# Altium schematic sheet 2401_Test_Board_V1.1.SCHDOC
size A4
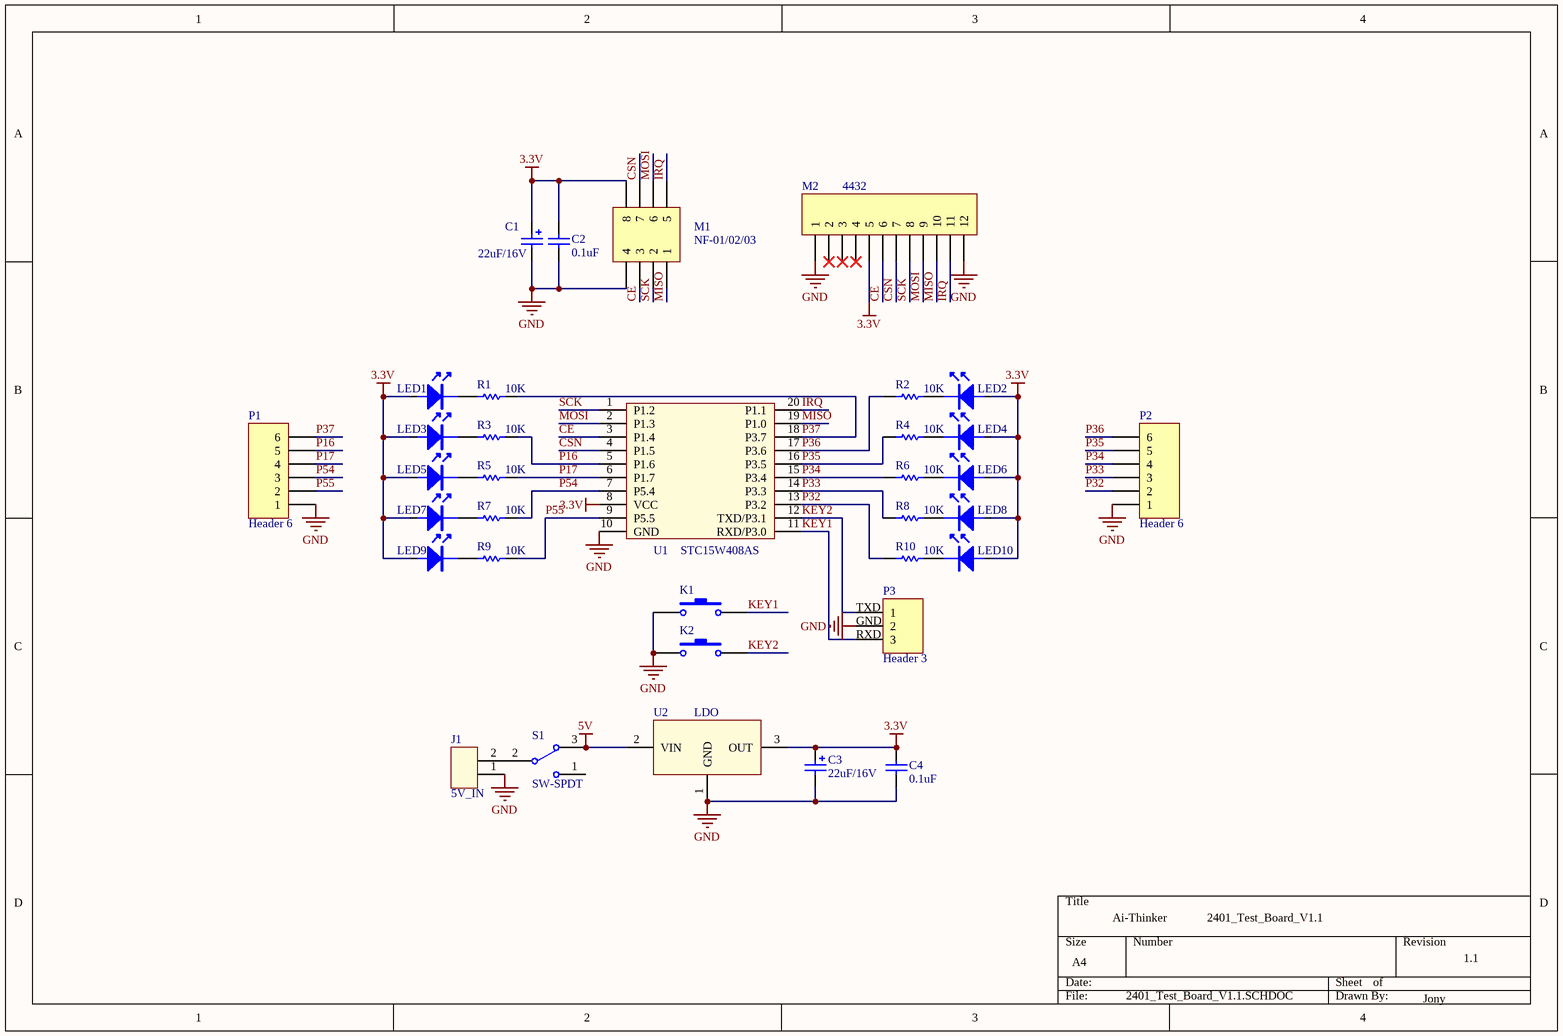
[diagram p0: 2401_Test_Board_V1.1.SCHDOC]

## Parts
C1  22uF/16V  [CAP4X7]
C2  0.1uF  [C0402]
C3  22uF/16V  [CAP4X7]
C4  0.1uF  [C0402]
J1  5V_IN  [2Pin-YAW396]
K1  (no value)  [KEY-6*6-SMD]
K2  (no value)  [KEY-6*6-SMD]
LED1  (no value)  [LED_0603]
LED2  (no value)  [LED_0603]
LED3  (no value)  [LED_0603]
LED4  (no value)  [LED_0603]
LED5  (no value)  [LED_0603]
LED6  (no value)  [LED_0603]
LED7  (no value)  [LED_0603]
LED8  (no value)  [LED_0603]
LED9  (no value)  [LED_0603]
LED10  (no value)  [LED_0603]
M1  NF-01/02/03  [HDR2X4_CEN]
M2  4432  [MHDR1X12]
P1  Header 6  [HDR1X6]
P2  Header 6  [HDR1X6]
P3  Header 3  [HDR1X3]
R1  10K  [R0402]
R2  10K  [R0402]
R3  10K  [R0402]
R4  10K  [R0402]
R5  10K  [R0402]
R6  10K  [R0402]
R7  10K  [R0402]
R8  10K  [R0402]
R9  10K  [R0402]
R10  10K  [R0402]
S1  SW-SPDT  [SW-SPDT]
U1  STC15W408AS
U2  LDO

## Nets
3.3V: C1.1 C2.2 C3.1 C4.2 LED1.1(A) LED2.1(A) LED3.1(A) LED4.1(A) LED5.1(A) LED6.1(A) LED7.1(A) LED8.1(A) LED9.1(A) LED10.1(A) M1.8 M2.5 U1.8(VCC) U2.3(OUT)
5V: S1.3 U2.2(VIN)
GND: C1.2 C2.1 C3.2 C4.1 J1.1 K1.1 K2.1 M1.4 M2.1 M2.12 P1.1 P2.1 P3.2 U1.10(GND) U2.1(GND)
CE: M1.3 M2.6 U1.3(P1.4)
CSN: M1.7 M2.7 U1.4(P1.5)
IRQ: M1.5 M2.11 U1.20(P1.1)
KEY1: K1.2 P3.3 U1.11(RXD/P3.0)
KEY2: K2.2 P3.1 U1.12(TXD/P3.1)
MISO: M1.1 M2.10 U1.19(P1.0)
MOSI: M1.6 M2.9 U1.2(P1.3)
P16: P1.5 R3.2 U1.5(P1.6)
P17: P1.4 R5.2 U1.6(P1.7)
P32: P2.2 R10.1 U1.13(P3.2)
P33: P2.3 R8.1 U1.14(P3.3)
P34: P2.4 R6.1 U1.15(P3.4)
P35: P2.5 R4.1 U1.16(P3.5)
P36: P2.6 R2.1 U1.17(P3.6)
P37: P1.6 R1.2 U1.18(P3.7)
P54: P1.3 R7.2 U1.7(P5.4)
P55: P1.2 R9.2 U1.9(P5.5)
SCK: M1.2 M2.8 U1.1(P1.2)
NetJ1_2: J1.2 S1.2
NetLED1_2: LED1.2(K) R1.1
NetLED2_2: LED2.2(K) R2.2
NetLED3_2: LED3.2(K) R3.1
NetLED4_2: LED4.2(K) R4.2
NetLED5_2: LED5.2(K) R5.1
NetLED6_2: LED6.2(K) R6.2
NetLED7_2: LED7.2(K) R7.1
NetLED8_2: LED8.2(K) R8.2
NetLED9_2: LED9.2(K) R9.1
NetLED10_2: LED10.2(K) R10.2

Not connected (* = marked no-connect by the designer): M2 2* 3* 4*; S1 1

## Notes on the sheet
- (near P3) TXD
- (near P3) GND
- (near P3) RXD
- Ai-Thinker
- 2401_Test_Board_V1.1
- Jony
- 1.1

## Library data of the parts
C1 C3 = Cap+
C2 C4 = Cap
J1 = 2Pin
K1 K2 = KEY: Published: 24-Mar-1999; LatestRevisionDate: 17-Jul-2002; LatestRevisionNote: Re-released for DXP Platform.; PackageReference: SPST-2; Publisher: Altium Limited; PackageDescription: Switch; 2 Leads
LED1-LED10 = LED: SMD0603 LED
M1 = Header 4X2A: Header, 4-Pin, Dual row; LatestRevisionDate: 17-Jul-2002; LatestRevisionNote: Re-released for DXP Platform.; Publisher: Altium Limited
M2 = MHDR1X12: Header, 12-Pin; LatestRevisionDate: 17-Jul-2002; LatestRevisionNote: Re-released for DXP Platform.; Publisher: Altium Limited
P1 P2 = Header 6: Header, 6-Pin; LatestRevisionDate: 17-Jul-2002; LatestRevisionNote: Re-released for DXP Platform.; Publisher: Altium Limited
P3 = Header 3: Header, 3-Pin; LatestRevisionDate: 17-Jul-2002; LatestRevisionNote: Re-released for DXP Platform.; Publisher: Altium Limited
R1-R10 = Res
S1 = SW-SPDT: SPDT Subminiature Toggle Switch, Right Angle Mounting, Vertical Actuation; Published: 24-Mar-1999; LatestRevisionDate: 17-Dec-2003; LatestRevisionNote: Schematic revised, PCB Footprint replaced.; DatasheetVersion: 05-Dec-2000; PackageReference: TL36WW15050; Publisher: Altium Limited; PackageDescription: Switch; 4 Leads; ComponentLink1Description: Manufacturer Link; ComponentLink1URL: http://www.apem.com
U2 = LDO7333